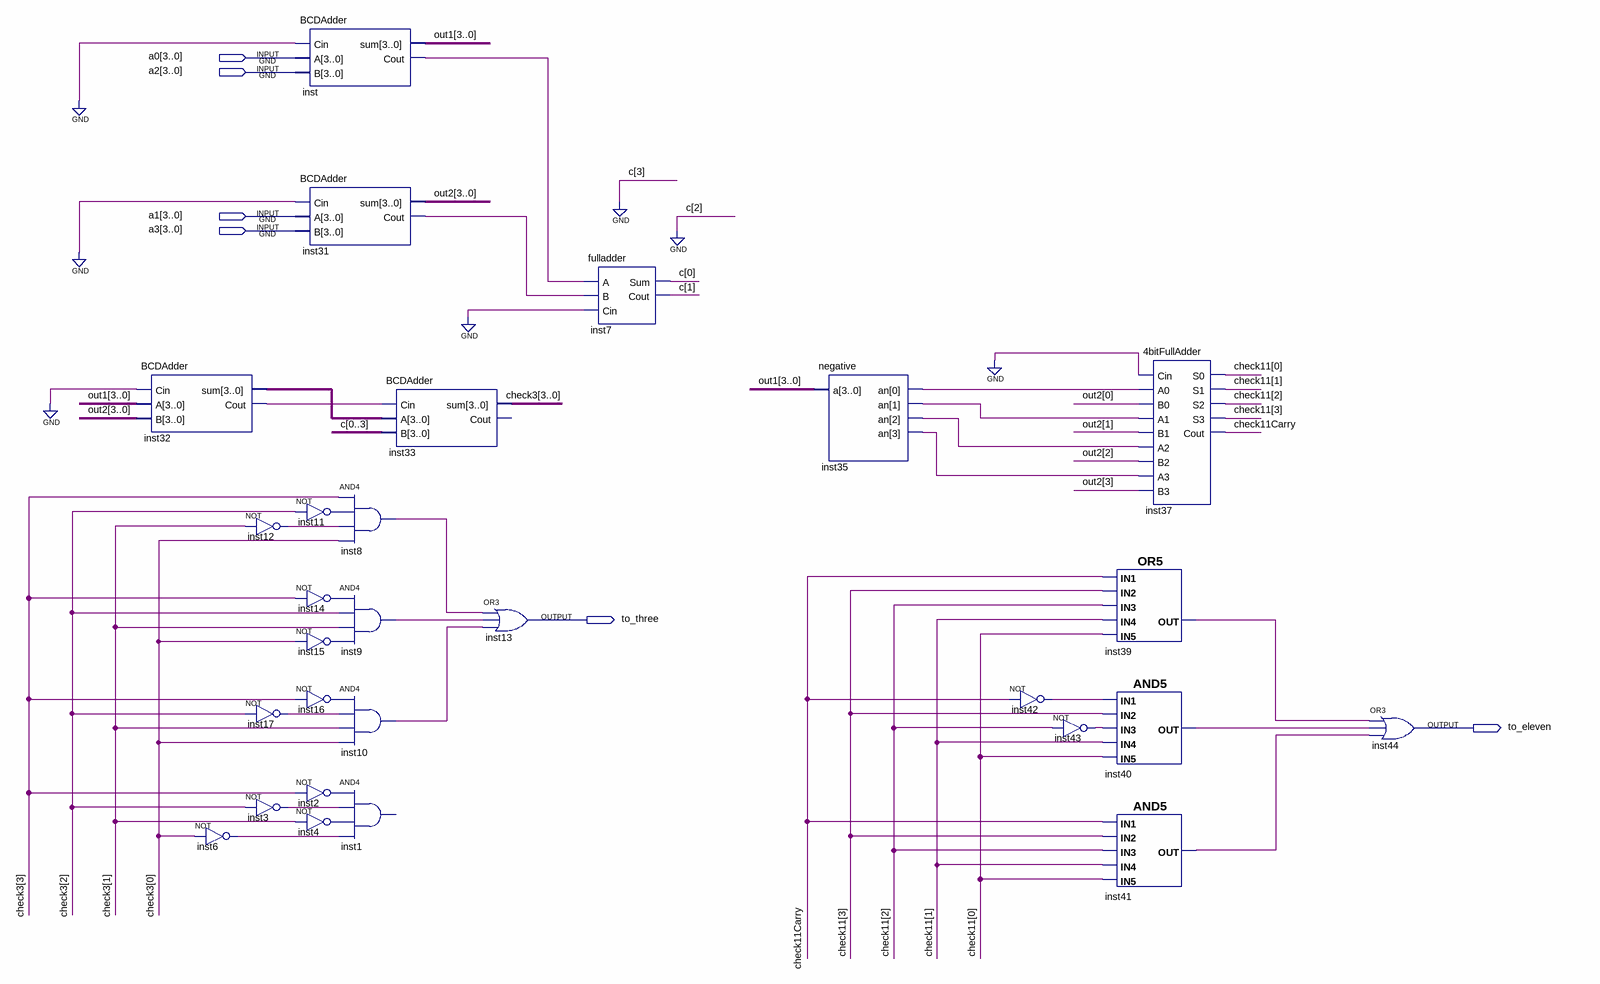
[diagram p0: schematic sheet]
// Quartus schematic main1.bdf as structural Verilog: 28 symbols, 6 pins
module main1 (
  input  [3:0] a0,
  input  [3:0] a2,
  input  [3:0] a1,
  input  [3:0] a3,
  output to_three,
  output to_eleven
);

  wire check11Carry, inst2_out, inst3_out, inst4_out, inst6_out, inst8_out, inst9_out, inst10_out,
       inst11_out, inst12_out, inst14_out, inst15_out, inst16_out, inst17_out, inst31_cout, inst32_cout,
       inst35_an, inst35_an_2, inst35_an_3, inst35_an_4, inst39_out, inst40_out, inst41_out, inst42_out,
       inst43_out, inst_cout;
  wire [1:0] c;
  wire [3:0] check3, check11, inst32_sum, out1, out2;

  BCDAdder inst32 (.Cin(1'b0), .A(out1), .B(out2), .sum(inst32_sum), .Cout(inst32_cout));
  not inst6 (inst6_out, check3[0]);
  not inst12 (inst12_out, check3[1]);
  not inst17 (inst17_out, check3[2]);
  not inst3 (inst3_out, check3[2]);
  BCDAdder inst (.Cin(1'b0), .A(a0), .B(a2), .sum(out1), .Cout(inst_cout));
  BCDAdder inst31 (.Cin(1'b0), .A(a1), .B(a3), .sum(out2), .Cout(inst31_cout));
  not inst11 (inst11_out, check3[2]);
  not inst14 (inst14_out, check3[3]);
  not inst15 (inst15_out, check3[0]);
  not inst16 (inst16_out, check3[3]);
  not inst2 (inst2_out, check3[3]);
  not inst4 (inst4_out, check3[1]);
  BCDAdder inst33 (.Cin(inst32_cout), .A(inst32_sum), .B({c[0], c[1], 2'b00}), .sum(check3));  // open: Cout
  and inst8 (inst8_out, check3[3], inst11_out, inst12_out, check3[0]);
  and inst9 (inst9_out, inst14_out, check3[2], check3[1], inst15_out);
  and inst10 (inst10_out, inst16_out, inst17_out, check3[1], check3[0]);
  // AND4 inst1 has open pins: IN1=inst2_out, IN2=inst3_out, IN3=inst4_out, IN4=inst6_out, OUT=open
  or inst13 (to_three, inst8_out, inst9_out, inst10_out);
  fulladder inst7 (.A(inst_cout), .B(inst31_cout), .Cin(1'b0), .Sum(c[0]), .Cout(c[1]));
  negative inst35 (.a(out1), .an({inst35_an_3, inst35_an_2, inst35_an, inst35_an_4}));
  not inst42 (inst42_out, check11Carry);
  not inst43 (inst43_out, check11[2]);
  \4bitFullAdder  inst37 (
    .Cin(1'b0), .A0(inst35_an_4), .B0(out2[0]), .A1(inst35_an), .B1(out2[1]), .A2(inst35_an_2), .B2(out2[2]),
    .A3(inst35_an_3), .B3(out2[3]), .S0(check11[0]), .S1(check11[1]), .S2(check11[2]), .S3(check11[3]),
    .Cout(check11Carry));
  or inst39 (inst39_out, check11Carry, check11[3], check11[2], check11[1], check11[0]);
  and inst40 (inst40_out, inst42_out, check11[3], inst43_out, check11[1], check11[0]);
  and inst41 (inst41_out, check11Carry, check11[3], check11[2], check11[1], check11[0]);
  or inst44 (to_eleven, inst39_out, inst40_out, inst41_out);
endmodule
